# Altium schematic sheet Pins.SchDoc
size A4
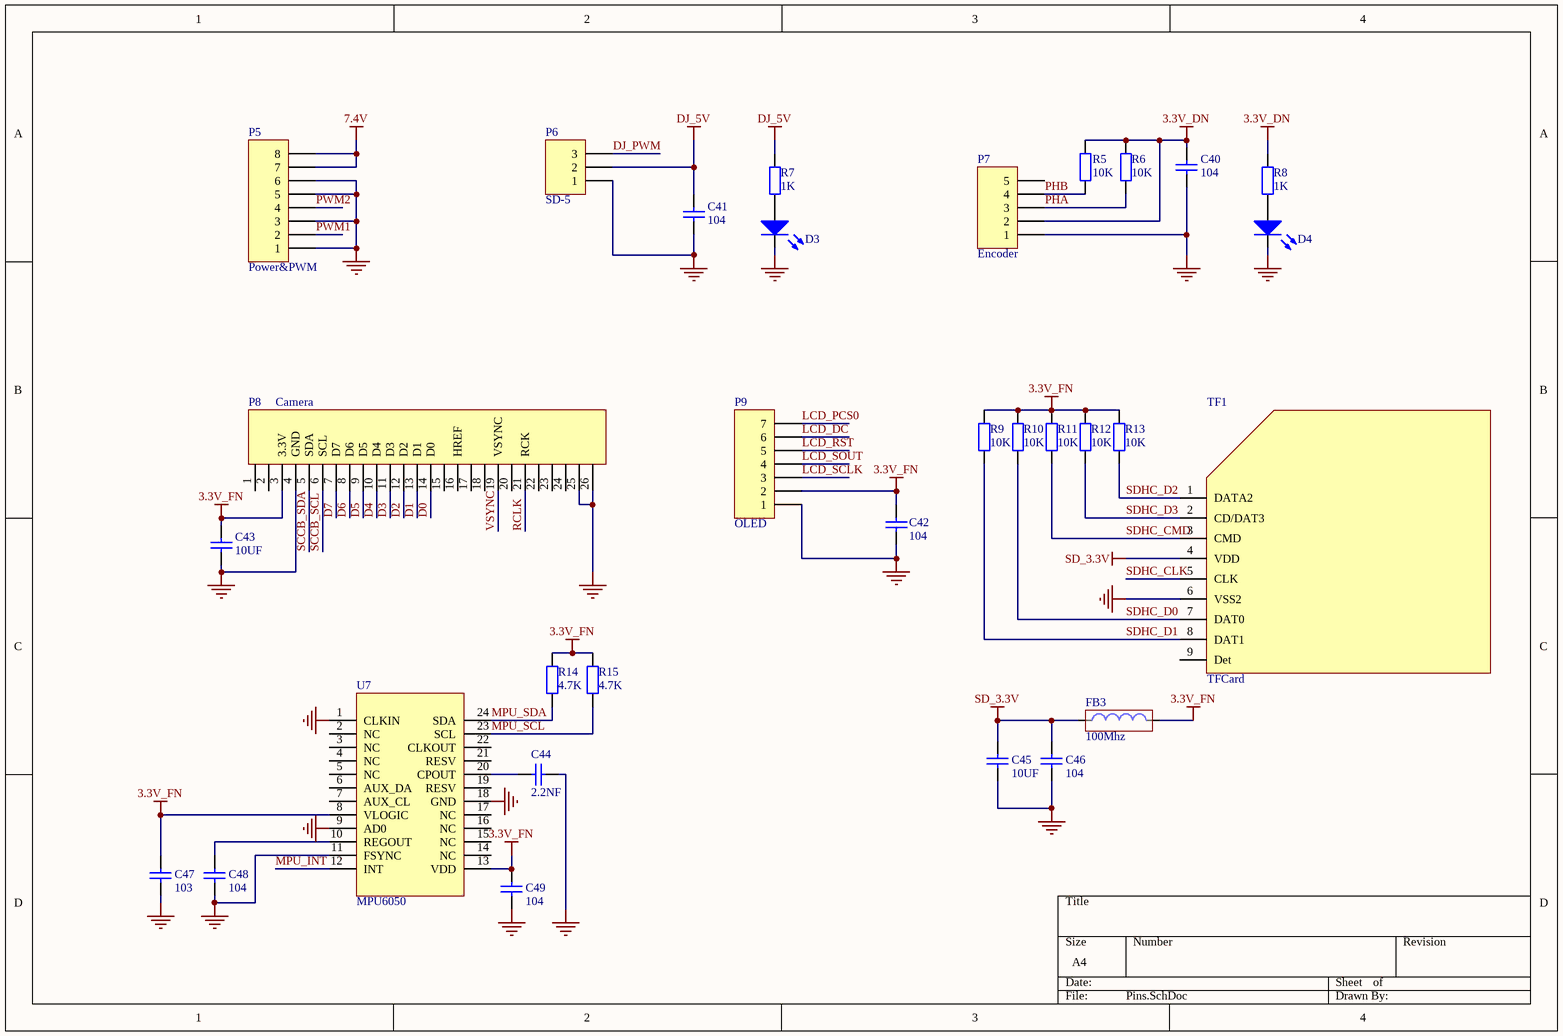
[diagram p0: Pins.SchDoc]

## Parts
C40  104  [0805]
C41  104  [0805]
C42  104  [0805]
C43  10UF  [1206]
C44  2.2NF  [0805]
C45  10UF  [1206]
C46  104  [0805]
C47  103  [0805]
C48  104  [0805]
C49  104  [0805]
D3  Led  [0805]  (value not drawn)
D4  Led  [0805]  (value not drawn)
FB3  100Mhz  [0805]
P5  Power&PWM  [8P-2.54]
P6  SD-5  [3PIN-2.54mm]
P7  Encoder  [5P-2.54]
P8  Camera  [FPC-0.5-24P]
P9  OLED  [HDR1X7]
R5  10K  [0805]
R6  10K  [0805]
R7  1K  [0805]
R8  1K  [0805]
R9  10K  [0805]
R10  10K  [0805]
R11  10K  [0805]
R12  10K  [0805]
R13  10K  [0805]
R14  4.7K  [0805]
R15  4.7K  [0805]
TF1  TFCard  [SD]
U7  MPU6050  [QFN-24P]

## Nets
3.3V_DN: C40.2 P7.2 R5.2 R6.2 R8.1
3.3V_FN: C42.1 C43.2 C47.1 C49.2 FB3.2 P8.3(3.3V) P9.2 R9.2 R10.2 R11.2 R12.2 R13.2 R14.2 R15.2 U7.8(VLOGIC) U7.13(VDD)
7.4V: P5.7 P5.8
DJ_5V: C41.2 P6.2 R7.1
GND: C40.1 C41.1 C42.2 C43.1 C44.2 C45.2 C46.1 C47.2 C48.1 C49.1 D3.2 D4.2 P5.1 P5.3 P5.5 P5.6 P6.1 P7.1 P8.4(GND) P8.25(GND) P8.26(GND) P9.1 TF1.6(VSS2) U7.1(CLKIN) U7.9(AD0) U7.11(FSYNC) U7.18(GND)
SD_3.3V: C45.1 C46.2 FB3.1 TF1.4(VDD)
D0: P8.14(D0)
D1: P8.13(D1)
D2: P8.12(D2)
D3: P8.11(D3)
D4: P8.10(D4)
D5: P8.9(D5)
D6: P8.8(D6)
D7: P8.7(D7)
DJ_PWM: P6.3
LCD_DC: P9.6
LCD_PCS0: P9.7
LCD_RST: P9.5
LCD_SCLK: P9.3
LCD_SOUT: P9.4
MPU_INT: U7.12(INT)
MPU_SCL: R15.1 U7.23(SCL)
MPU_SDA: R14.1 U7.24(SDA)
PHA: P7.3 R6.1
PHB: P7.4 R5.1
PWM1: P5.2
PWM2: P5.4
RCLK: P8.21(RCK)
SCCB_SCL: P8.6(SCL)
SCCB_SDA: P8.5(SDA)
SDHC_CLK: TF1.5(CLK)
SDHC_CMD: R11.1 TF1.3(CMD)
SDHC_D0: R10.1 TF1.7(DAT0)
SDHC_D1: R9.1 TF1.8(DAT1)
SDHC_D2: R13.1 TF1.1(DATA2)
SDHC_D3: R12.1 TF1.2(CD/DAT3)
VSYNC: P8.19(VSYNC)
NetC44_1: C44.1 U7.20(CPOUT)
NetC48_2: C48.2 U7.10(REGOUT)
NetD3_1: D3.1 R7.2
NetD4_1: D4.1 R8.2

Not connected (* = marked no-connect by the designer): P7 5; P8 1(0) 2 15(OE) 16(HREF) 17(WEN) 18(WRST) 20(XCLK) 22(REST) 23 24; TF1 9(Det); U7 2(NC) 3(NC) 4(NC) 5(NC) 6(AUX_DA) 7(AUX_CL) 14(NC) 15(NC) 16(NC) 17(NC) 19(RESV) 21(RESV) 22(CLKOUT)

## Library data of the parts
C40-C49 = Cap
FB3 = Inductor
P5 = Header 8: Header, 8-Pin; LatestRevisionDate: 17-Jul-2002; LatestRevisionNote: Re-released for DXP Platform.; Publisher: Altium Limited
P6 = Header 3: Header, 3-Pin; LatestRevisionDate: 17-Jul-2002; LatestRevisionNote: Re-released for DXP Platform.; Publisher: Altium Limited
P7 = Header 5: Header, 5-Pin; LatestRevisionDate: 17-Jul-2002; LatestRevisionNote: Re-released for DXP Platform.; Publisher: Altium Limited
P8 = 野火鹰眼 排线
P9 = Header 7: Header, 7-Pin; LatestRevisionDate: 17-Jul-2002; LatestRevisionNote: Re-released for DXP Platform.; Publisher: Altium Limited
R5-R15 = Rest
TF1 = SD卡